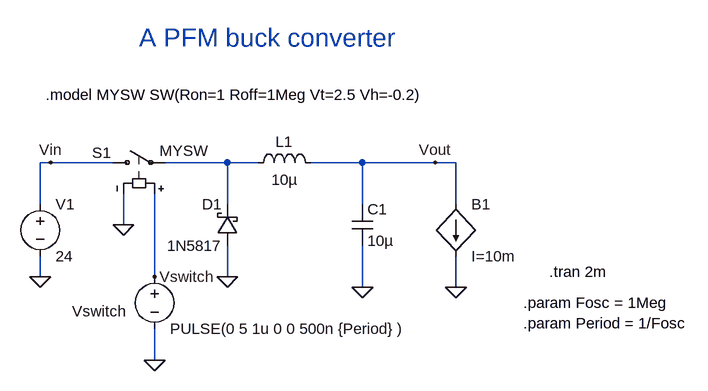
[diagram p0: schematic A PFM buck converter.asc]
A PFM buck converter.asc, the LTspice schematic file:
Version 4
SHEET 1 1072 680
WIRE 64 112 48 112
WIRE 160 112 64 112
WIRE 336 112 240 112
WIRE 384 112 336 112
WIRE 544 112 464 112
WIRE 656 112 544 112
WIRE 688 112 656 112
WIRE 48 176 48 112
WIRE 336 176 336 112
WIRE 544 176 544 112
WIRE 688 176 688 112
WIRE 176 208 176 160
WIRE 48 288 48 256
WIRE 224 288 224 160
WIRE 336 288 336 240
WIRE 544 304 544 240
WIRE 688 304 688 256
WIRE 224 416 224 368
FLAG 48 288 0
FLAG 176 208 0
FLAG 336 288 0
FLAG 224 416 0
FLAG 544 304 0
FLAG 688 304 0
FLAG 656 112 Vout
FLAG 64 112 Vin
FLAG 224 288 Vswitch
SYMBOL voltage 48 160 R0
SYMATTR InstName V1
SYMATTR Value 24
SYMBOL voltage 224 272 R0
WINDOW 0 -127 69 Left 2
WINDOW 123 0 0 Left 0
WINDOW 39 0 0 Left 0
SYMATTR InstName Vswitch
SYMATTR Value PULSE(0 5 1u 0 0 500n {Period} )
SYMBOL schottky 352 240 R180
WINDOW 0 24 64 Left 2
WINDOW 3 24 0 Left 2
SYMATTR InstName D1
SYMATTR Value 1N5817
SYMATTR Description Zener Diode
SYMATTR Type zener
SYMBOL ind 368 128 R270
WINDOW 0 32 56 VTop 2
WINDOW 3 5 56 VBottom 2
SYMATTR InstName L1
SYMATTR Value 10µ
SYMBOL cap 528 176 R0
SYMATTR InstName C1
SYMATTR Value 10µ
SYMBOL sw 144 112 R270
WINDOW 0 15 -16 VRight 2
WINDOW 3 18 88 VRight 2
SYMATTR InstName S1
SYMATTR Value MYSW
SYMBOL bi 688 176 R0
SYMATTR InstName B1
SYMATTR Value I=10m
TEXT 792 328 Left 2 !.param Fosc = 1Meg\n.param Period = 1/Fosc
TEXT 56 8 Left 2 !.model MYSW SW(Ron=1 Roff=1Meg Vt=2.5 Vh=-0.2)
TEXT 200 -80 Left 4 ;A PFM buck converter
TEXT 832 280 Left 2 !.tran 2m

The netlist it stands for:
* A PFM buck converter.asc
V1 Vin 0 24
Vswitch Vswitch 0 PULSE(0 5 1u 0 0 500n {Period} )
D1 0 N001 1N5817
L1 N001 Vout 10µ
C1 Vout 0 10µ
S1 Vin N001 Vswitch 0 MYSW
B1 Vout 0 I=10m
.model D D
.lib standard.dio
.param Fosc = 1Meg
.param Period = 1/Fosc
.model MYSW SW(Ron=1 Roff=1Meg Vt=2.5 Vh=-0.2)
* A PFM buck converter
.tran 2m
.backanno
.end